# Altium schematic sheet Analog_output.SchDoc
size A; SheetNumber: 7; SheetTotal: 11
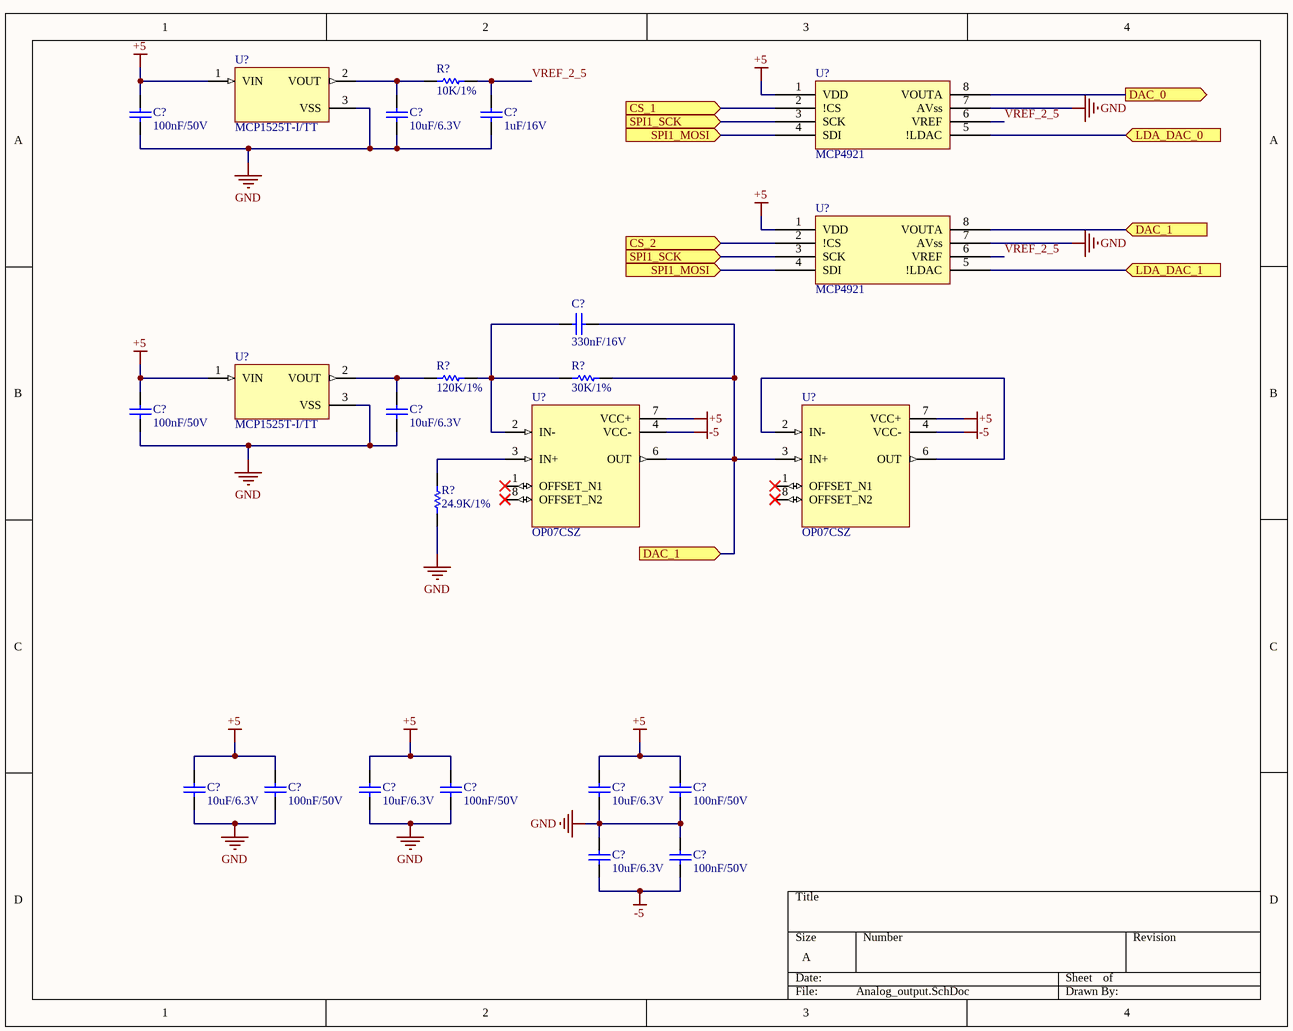
[diagram p0: Analog_output.SchDoc]

## Parts
(Parts that share a designator on the sheet are numbered #1, #2 ... from top to bottom, then left to right.)
C?#1  100nF/50V  [CAP_0805]
C?#2  10uF/6.3V  [CAP_0805]
C?#3  1uF/16V  [CAP_0805]
C?#4  330nF/16V  [CAP_0805]
C?#5  100nF/50V  [CAP_0805]
C?#6  10uF/6.3V  [CAP_0805]
C?#7  10uF/6.3V  [CAP_0805]
C?#8  100nF/50V  [CAP_0805]
C?#9  10uF/6.3V  [CAP_0805]
C?#10  100nF/50V  [CAP_0805]
C?#11  10uF/6.3V  [CAP_0805]
C?#12  100nF/50V  [CAP_0805]
C?#13  10uF/6.3V  [CAP_0805]
C?#14  100nF/50V  [CAP_0805]
R?#1  10K/1%  [RES_0805]
R?#2  120K/1%  [RES_0805]
R?#3  30K/1%  [RES_0805]
R?#4  24.9K/1%  [RES_0805]
U?#1  MCP1525T-I/TT  [SOT95P237X112-3N]
U?#2  MCP4921  [SOIC127P600X175-8N]
U?#3  MCP4921  [SOIC127P600X175-8N]
U?#4  MCP1525T-I/TT  [SOT95P237X112-3N]
U?#5  OP07CSZ  [SOIC127P600X175-8N]
U?#6  OP07CSZ  [SOIC127P600X175-8N]

## Ports
CS_1 (in), CS_2 (in), DAC_0 (out), DAC_1 (in), LDA_DAC_0 (in), LDA_DAC_1 (in), SPI1_MOSI (in), SPI1_SCK (in)

## Nets
+5: C?#1.2 C?#5.2 C?#7.2 C?#8.2 C?#9.2 C?#10.2 C?#11.2 C?#12.2 U?#1.1(VIN) U?#2.1(VDD) U?#3.1(VDD) U?#4.1(VIN) U?#5.7(VCC+) U?#6.7(VCC+)
-5: C?#13.1 C?#14.1 U?#5.4(VCC-) U?#6.4(VCC-)
GND: C?#1.1 C?#2.1 C?#3.1 C?#5.1 C?#6.1 C?#7.1 C?#8.1 C?#9.1 C?#10.1 C?#11.1 C?#12.1 C?#13.2 C?#14.2 R?#4.1 U?#1.3(VSS) U?#2.7(AVss) U?#3.7(AVss) U?#4.3(VSS)
CS_1: U?#2.2(!CS) ; port CS_1
CS_2: U?#3.2(!CS) ; port CS_2
DAC_0: U?#2.8(VOUTA) ; port DAC_0
DAC_1: C?#4.1 R?#3.2 U?#3.8(VOUTA) U?#5.6(OUT) U?#6.3(IN+) ; port DAC_1
LDA_DAC_0: U?#2.5(!LDAC) ; port LDA_DAC_0
LDA_DAC_1: U?#3.5(!LDAC) ; port LDA_DAC_1
SPI1_MOSI: U?#2.4(SDI) U?#3.4(SDI) ; port SPI1_MOSI
SPI1_SCK: U?#2.3(SCK) U?#3.3(SCK) ; port SPI1_SCK
VREF_2_5: C?#3.2 R?#1.1 U?#2.6(VREF) U?#3.6(VREF)
NetC?#2_2: C?#2.2 R?#1.2 U?#1.2(VOUT)
NetC?#4_2: C?#4.2 R?#2.2 R?#3.1 U?#5.2(IN-)
NetC?#6_2: C?#6.2 R?#2.1 U?#4.2(VOUT)
NetR?#4_2: R?#4.2 U?#5.3(IN+)
NetU?#6_2: U?#6.2(IN-) U?#6.6(OUT)

Not connected (* = marked no-connect by the designer): U?#5 1(OFFSET_N1)* 8(OFFSET_N2)*; U?#6 1(OFFSET_N1)* 8(OFFSET_N2)*

## Library data of the parts
C?#1-C?#14 = Capacitor: Size: 0805
  C?#1 C?#5 C?#8 C?#10 C?#12 C?#14: URL: https://www.thegioiic.com/tu-gom-0805-100nf-0-1uf-50v; Value: 100nF/50V
  C?#2 C?#6 C?#7 C?#9 C?#11 C?#13: URL: https://www.thegioiic.com/tu-gom-0805-10uf-6-3v; Value: 10uF/6.3V
  C?#3: URL: https://www.thegioiic.com/tu-gom-0805-1uf-16v; Value: 1uF/16V
  C?#4: URL: https://www.thegioiic.com/tu-gom-0805-330nf-16v; Value: 330nF/16V
R?#1-R?#4 = Resistor: Size: 0805
  R?#1: URL: https://www.thegioiic.com/dien-tro-10-kohm-0805-1-; Value: 10K/1%
  R?#2: URL: https://www.thegioiic.com/dien-tro-120-kohm-0805-1-; Value: 120K/1%
  R?#3: URL: https://www.thegioiic.com/dien-tro-30-kohm-0805-1-; Value: 30K/1%
  R?#4: URL: https://www.thegioiic.com/dien-tro-24-9-kohm-0805-1-; Value: 24.9K/1%
U?#1 U?#4 = MCP1525T-I/TT: Series Voltage Reference IC Â±1% SOT-23-3; Value: 2.5VDC; Size: SOT-23; URL: https://www.thegioiic.com/mcp1525t-i-tt-ic-tham-chieu-dien-ap-2-5v-sot-23
U?#2 U?#3 = MCP4921: Interface SPI; Value: MCP4921-E/SN; Size: 8-SOIC; URL: https://www.thegioiic.com/mcp4921-e-sn-ic-dac-12-bit-1-channel-8-soic
U?#5 U?#6 = OP07CSZ: Low-Offset Voltage Operational Amplifier; Size: 8-SOIC; URL: https://www.thegioiic.com/op07csz-ic-opamp-general-purpose-amplifier-1-circuit-600khz-8-soic; Value: OP07CSZ